# Altium project roach2_project.PrjPCB (part 2 of 13)

## Sheet hwmon.SchDoc: Hardware Monitoring
size A3; Date: DO NOT USE, RATHER USE PROJ OPTIONS; DrawnBy: DO NOT USE, RATHER USE PROJ OPTIONS; Engineer: DO NOT USE, RATHER USE PROJ OPTIONS; Organization: DO NOT USE, RATHER USE PROJ OPTIONS; DocumentNumber: DO NOT USE, RATHER USE PROJ OPTIONS; Revision: DO NOT USE, RATHER USE PROJ OPTIONS; SheetNumber: 3; SheetTotal: 27; SCH_Sheet_Filename: hwmon.SchDoc; CurrentTime: DO NOT USE, RATHER USE PROJ OPTIONS; Time: DO NOT USE, RATHER USE PROJ OPTIONS; DocumentFullPathAndName: DO NOT USE, RATHER USE PROJ OPTIONS; DocumentName: DO NOT USE, RATHER USE PROJ OPTIONS; ModifiedDate: DO NOT USE, RATHER USE PROJ OPTIONS; ImagePath: DO NOT USE, RATHER USE PROJ OPTIONS
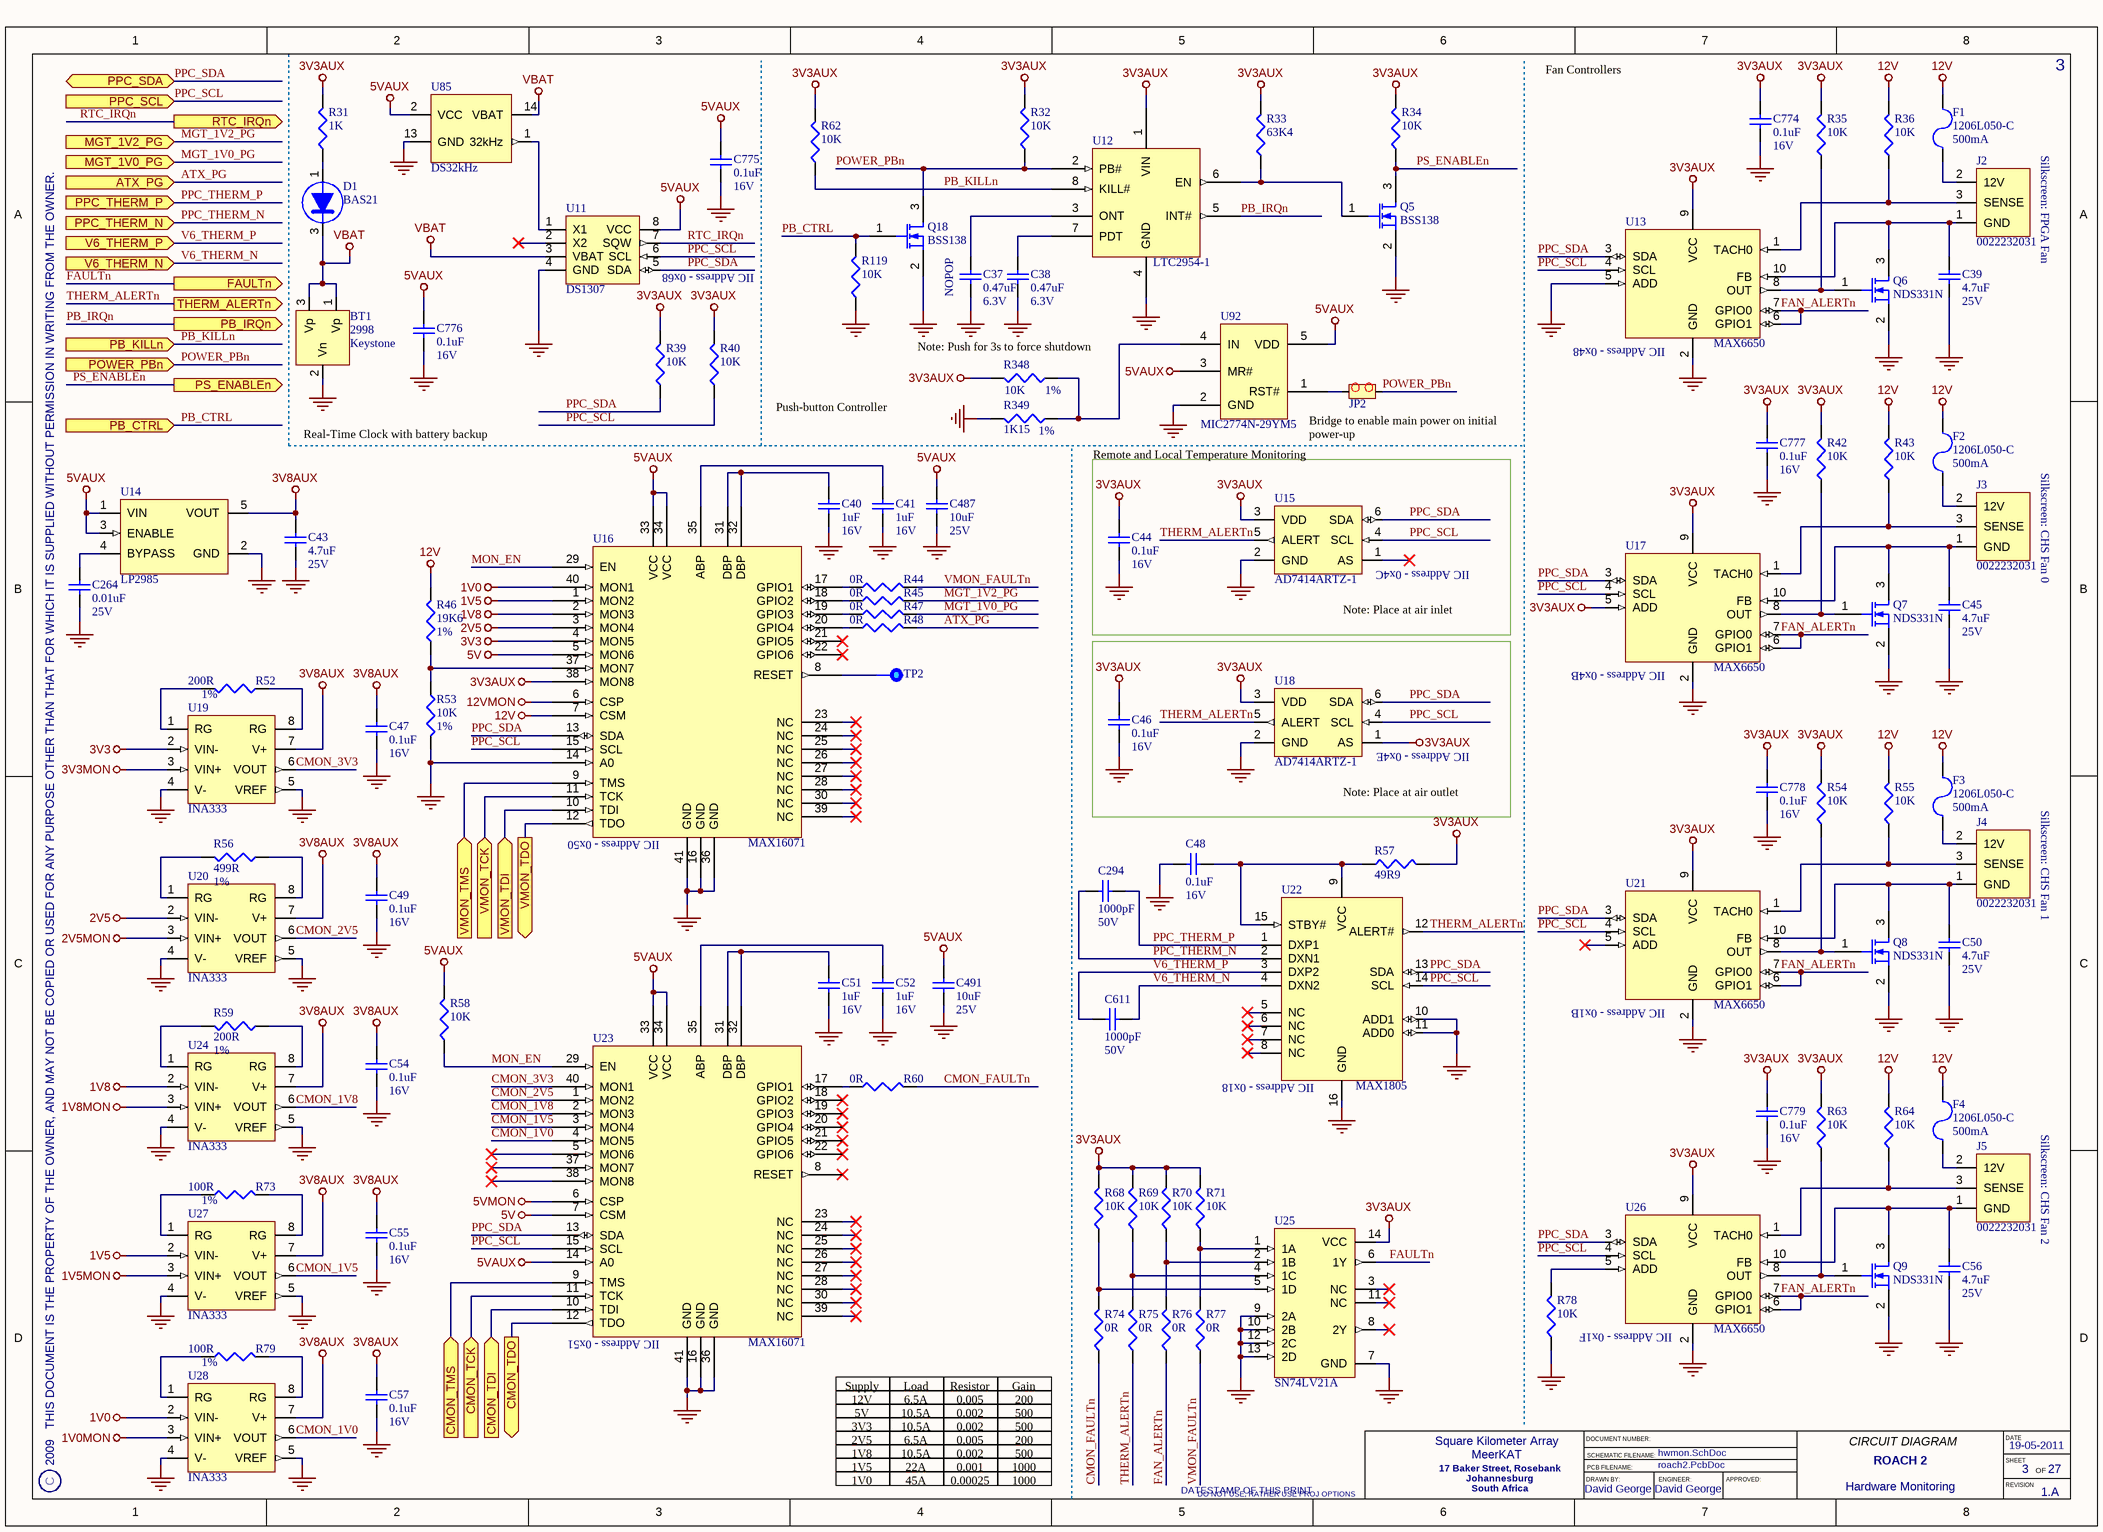
[diagram p3: hwmon.SchDoc]

### Parts
BT1  Manufacturer: Keystone  [KEYELCO_2998]  (hidden comment: 2998)
C37  value 0.47uF  Rating: 6.3V  [CAPC1005X55L]  (hidden comment: CapStd)
C38  value 0.47uF  Rating: 6.3V  [CAPC1005X55L]  (hidden comment: CapStd)
C39  Rating: 25V  [CAPC2012X127L]  (hidden comment: 4.7uF)
C40  Rating: 16V  [CAPC2012X127L]  (hidden comment: 1uF)
C41  Rating: 16V  [CAPC2012X127L]  (hidden comment: 1uF)
C43  Rating: 25V  [CAPC2012X127L]  (hidden comment: 4.7uF)
C44  Rating: 16V  [CAPC1005X60L]  (hidden comment: 0.1uF)
C45  Rating: 25V  [CAPC2012X127L]  (hidden comment: 4.7uF)
C46  Rating: 16V  [CAPC1005X60L]  (hidden comment: 0.1uF)
C47  Rating: 16V  [CAPC1005X60L]  (hidden comment: 0.1uF)
C48  Rating: 16V  [CAPC1005X60L]  (hidden comment: 0.1uF)
C49  Rating: 16V  [CAPC1005X60L]  (hidden comment: 0.1uF)
C50  Rating: 25V  [CAPC2012X127L]  (hidden comment: 4.7uF)
C51  Rating: 16V  [CAPC2012X127L]  (hidden comment: 1uF)
C52  Rating: 16V  [CAPC2012X127L]  (hidden comment: 1uF)
C54  Rating: 16V  [CAPC1005X60L]  (hidden comment: 0.1uF)
C55  Rating: 16V  [CAPC1005X60L]  (hidden comment: 0.1uF)
C56  Rating: 25V  [CAPC2012X127L]  (hidden comment: 4.7uF)
C57  Rating: 16V  [CAPC1005X60L]  (hidden comment: 0.1uF)
C264  value 0.01uF  Rating: 25V  [CAPC1005X55L]  (hidden comment: CapStd)
C294  Rating: 50V  [CAPC1005X55L]  (hidden comment: 1000pF)
C487  Rating: 25V  [CAPC3225X200L]  (hidden comment: 10uF)
C491  Rating: 25V  [CAPC3225X200L]  (hidden comment: 10uF)
C611  Rating: 50V  [CAPC1005X55L]  (hidden comment: 1000pF)
C774  Rating: 16V  [CAPC1005X60L]  (hidden comment: 0.1uF)
C775  Rating: 16V  [CAPC1005X60L]  (hidden comment: 0.1uF)
C776  Rating: 16V  [CAPC1005X60L]  (hidden comment: 0.1uF)
C777  Rating: 16V  [CAPC1005X60L]  (hidden comment: 0.1uF)
C778  Rating: 16V  [CAPC1005X60L]  (hidden comment: 0.1uF)
C779  Rating: 16V  [CAPC1005X60L]  (hidden comment: 0.1uF)
D1  BAS21  [SOT95P245X110-3N]
F1  Rating: 500mA  [FUSMC3215X145]  (hidden comment: 1206L050-C)
F2  Rating: 500mA  [FUSMC3215X145]  (hidden comment: 1206L050-C)
F3  Rating: 500mA  [FUSMC3215X145]  (hidden comment: 1206L050-C)
F4  Rating: 500mA  [FUSMC3215X145]  (hidden comment: 1206L050-C)
J2  0022232031  [MOLEX_0022232031]
J3  0022232031  [MOLEX_0022232031]
J4  0022232031  [MOLEX_0022232031]
J5  0022232031  [MOLEX_0022232031]
JP2  0022032021  [MOLEX_0022032021]  (value not drawn)
Q5  BSS138  [SOT95P245X110-3N]
Q6  NDS331N  [SOT95P245X110-3N]
Q7  NDS331N  [SOT95P245X110-3N]
Q8  NDS331N  [SOT95P245X110-3N]
Q9  NDS331N  [SOT95P245X110-3N]
Q18  BSS138  [SOT95P245X110-3N]
R31  1K  [RESC1005X40L]
R32  10K  [RESC1005X40L]
R33  63K4  [RESC1005X40L]
R34  10K  [RESC1005X40L]
R35  10K  [RESC1005X40L]
R36  10K  [RESC1005X40L]
R39  10K  [RESC1005X40L]
R40  10K  [RESC1005X40L]
R42  10K  [RESC1005X40L]
R43  10K  [RESC1005X40L]
R44  0R  [RESC1005X40L]
R45  0R  [RESC1005X40L]
R46  Tolerance: 1%  [RESC1005X40L]  (hidden comment: 19K6)
R47  0R  [RESC1005X40L]
R48  0R  [RESC1005X40L]
R52  Tolerance: 1%  [RESC1005X40L]  (hidden comment: 200R)
R53  Tolerance: 1%  [RESC1005X40L]  (hidden comment: 10K)
R54  10K  [RESC1005X40L]
R55  10K  [RESC1005X40L]
R56  Tolerance: 1%  [RESC1005X40L]  (hidden comment: 499R)
R57  49R9  [RESC1005X40L]
R58  10K  [RESC1005X40L]
R59  Tolerance: 1%  [RESC1005X40L]  (hidden comment: 200R)
R60  0R  [RESC1005X40L]
R62  10K  [RESC1005X40L]
R63  10K  [RESC1005X40L]
R64  10K  [RESC1005X40L]
R68  10K  [RESC1005X40L]
R69  10K  [RESC1005X40L]
R70  10K  [RESC1005X40L]
R71  10K  [RESC1005X40L]
R73  Tolerance: 1%  [RESC1005X40L]  (hidden comment: 100R)
R74  0R  [RESC1005X40L]
R75  0R  [RESC1005X40L]
R76  0R  [RESC1005X40L]
R77  0R  [RESC1005X40L]
R78  10K  [RESC1005X40L]
R79  Tolerance: 1%  [RESC1005X40L]  (hidden comment: 100R)
R119  10K  [RESC1005X40L]
R348  Tolerance: 1%  [RESC1005X40L]  (hidden comment: 10K)
R349  Tolerance: 1%  [RESC1005X40L]  (hidden comment: 1K15)
TP2  Testpoint  [TP100]  (value not drawn)  (no BOM)
U11  DS1307  [SOIC150-8_N]
U12  LTC2954-1  [TSOT-23-8]
U13  MAX6650  [10L_uMAX]
U14  LP2985  [SOT23-5]
U15  AD7414ARTZ-1  [SOT23-6]
U16  MAX16071  [TQFN-40]
U17  MAX6650  [10L_uMAX]
U18  AD7414ARTZ-1  [SOT23-6]
U19  INA333  [PW08]
U20  INA333  [PW08]
U21  MAX6650  [10L_uMAX]
U22  MAX1805  [QSOP-16]
U23  MAX16071  [TQFN-40]
U24  INA333  [PW08]
U25  SN74LV21A  [PW014]
U26  MAX6650  [10L_uMAX]
U27  INA333  [PW08]
U28  INA333  [PW08]
U85  DS32kHz  [SOIC127P1030X267-16N]
U92  MIC2774N-29YM5  [SOT23-5]

### Blocks framed on the sheet
IIC Address - 0x4C: C44 U15
IIC Address - 0x4E: C46 U18

### Ports
ATX_PG (in), CMON_TCK (in), CMON_TDI (in), CMON_TDO (out), CMON_TMS (in), FAULTn (out), MGT_1V0_PG (in), MGT_1V2_PG (in), PB_CTRL (in), PB_IRQn (out), PB_KILLn (in), POWER_PBn (in), PPC_SCL (in), PPC_SDA (bidir), PPC_THERM_N (in), PPC_THERM_P (in), PS_ENABLEn (out), RTC_IRQn (out), THERM_ALERTn (out), V6_THERM_N (in), V6_THERM_P (in), VMON_TCK (in), VMON_TDI (in), VMON_TDO (out), VMON_TMS (in)

### Nets
1V0: U16.40(MON1) U28.2(VIN-)
1V0MON: U28.3(VIN+)
1V5: U16.1(MON2) U27.2(VIN-)
1V5MON: U27.3(VIN+)
1V8: U16.2(MON3) U24.2(VIN-)
1V8MON: U24.3(VIN+)
2V5: U16.3(MON4) U20.2(VIN-)
2V5MON: U20.3(VIN+)
3V3: U16.4(MON5) U19.2(VIN-)
3V3AUX: C44.2 C46.2 C774.2 C777.2 C778.2 C779.2 R31.2 R32.2 R33.2 R34.2 R35.2 R39.2 R40.2 R42.2 R54.2 R57.2 R62.2 R63.2 R68.2 R69.2 R70.2 R71.2 R348.2 U12.1(VIN) U13.9(VCC) U15.3(VDD) U16.38(MON8) U17.5(ADD) U17.9(VCC) U18.1(AS) U18.3(VDD) U21.9(VCC) U25.14(VCC) U26.9(VCC)
3V3MON: U19.3(VIN+)
3V8AUX: C43.2 C47.2 C49.2 C54.2 C55.2 C57.2 U14.5(VOUT) U19.7(V+) U20.7(V+) U24.7(V+) U27.7(V+) U28.7(V+)
5V: U16.5(MON6) U23.7(CSM)
5VAUX: C487.2 C491.2 C775.2 C776.2 R58.2 U11.8(VCC) U14.1(VIN) U14.3(ENABLE) U16.33(VCC) U16.34(VCC) U23.14(A0) U23.33(VCC) U23.34(VCC) U85.2(VCC) U92.3(MR#) U92.5(VDD)
5VMON: U23.6(CSP)
12V: F1.1 F2.1 F3.1 F4.1 R36.2 R43.2 R46.2 R55.2 R64.2 U16.7(CSM)
12VMON: U16.6(CSP)
GND: BT1.2(Vn) C37.2 C38.2 C39.1 C40.1 C41.1 C43.1 C44.1 C45.1 C46.1 C47.1 C48.2 C49.1 C50.1 C51.1 C52.1 C54.1 C55.1 C56.1 C57.1 C264.1 C487.1 C491.1 C774.1 C775.1 C776.1 C777.1 C778.1 C779.1 Q5.2(S) Q6.2(S) Q7.2(S) Q8.2(S) Q9.2(S) Q18.2(S) R53.2 R78.1 R119.1 R349.2 U11.4(GND) U12.4(GND) U13.2(GND) U13.5(ADD) U14.2(GND) U15.2(GND) U16.14(A0) U16.16(GND) U16.36(GND) U16.41(GND) U17.2(GND) U18.2(GND) U19.4(V-) U19.5(VREF) U20.4(V-) U20.5(VREF) U21.2(GND) U22.10(ADD1) U22.11(ADD0) U22.16(GND) U23.16(GND) U23.36(GND) U23.41(GND) U24.4(V-) U24.5(VREF) U25.7(GND) U25.9(2A) U25.10(2B) U25.12(2C) U25.13(2D) U26.2(GND) U27.4(V-) U27.5(VREF) U28.4(V-) U28.5(VREF) U85.13(GND) U92.2(GND)
VBAT: BT1.1(Vp) BT1.3(Vp) D1.3(K) U11.3(VBAT) U85.14(VBAT)
ATX_PG: R48.2 ; port ATX_PG
CMON_1V0: U23.4(MON5) U28.6(VOUT)
CMON_1V5: U23.3(MON4) U27.6(VOUT)
CMON_1V8: U23.2(MON3) U24.6(VOUT)
CMON_2V5: U20.6(VOUT) U23.1(MON2)
CMON_3V3: U19.6(VOUT) U23.40(MON1)
CMON_FAULTn: R60.2 R74.1
CMON_TCK: U23.11(TCK) ; port CMON_TCK
CMON_TDI: U23.10(TDI) ; port CMON_TDI
CMON_TDO: U23.12(TDO) ; port CMON_TDO
CMON_TMS: U23.9(TMS) ; port CMON_TMS
FAN_ALERTn: R76.1 U13.6(GPIO1) U13.7(GPIO0) U17.6(GPIO1) U17.7(GPIO0) U21.6(GPIO1) U21.7(GPIO0) U26.6(GPIO1) U26.7(GPIO0)
FAULTn: U25.6(1Y) ; port FAULTn
MGT_1V0_PG: R47.2 ; port MGT_1V0_PG
MGT_1V2_PG: R45.2 ; port MGT_1V2_PG
MON_EN: R58.1 U16.29(EN) U23.29(EN)
PB_CTRL: Q18.1(G) R119.2 ; port PB_CTRL
PB_IRQn: U12.5(INT#) ; port PB_IRQn
PB_KILLn: R62.1 U12.8(KILL#) ; port PB_KILLn
POWER_PBn: JP2.2 Q18.3(D) R32.1 U12.2(PB#) ; port POWER_PBn
PPC_SCL: R40.1 U11.6(SCL) U13.4(SCL) U15.4(SCL) U16.15(SCL) U17.4(SCL) U18.4(SCL) U21.4(SCL) U22.14(SCL) U23.15(SCL) U26.4(SCL) ; port PPC_SCL
PPC_SDA: R39.1 U11.5(SDA) U13.3(SDA) U15.6(SDA) U16.13(SDA) U17.3(SDA) U18.6(SDA) U21.3(SDA) U22.13(SDA) U23.13(SDA) U26.3(SDA) ; port PPC_SDA
PPC_THERM_N: C294.1 U22.2(DXN1) ; port PPC_THERM_N
PPC_THERM_P: C294.2 U22.1(DXP1) ; port PPC_THERM_P
PS_ENABLEn: Q5.3(D) R34.1 ; port PS_ENABLEn
RTC_IRQn: U11.7(SQW) ; port RTC_IRQn
THERM_ALERTn: R75.1 U15.5(ALERT) U18.5(ALERT) U22.12(ALERT#) ; port THERM_ALERTn
V6_THERM_N: C611.1 U22.4(DXN2) ; port V6_THERM_N
V6_THERM_P: C611.2 U22.3(DXP2) ; port V6_THERM_P
VMON_FAULTn: R44.2 R77.1
VMON_TCK: U16.11(TCK) ; port VMON_TCK
VMON_TDI: U16.10(TDI) ; port VMON_TDI
VMON_TDO: U16.12(TDO) ; port VMON_TDO
VMON_TMS: U16.9(TMS) ; port VMON_TMS
NetC37_1: C37.1 U12.3(ONT)
NetC38_1: C38.1 U12.7(PDT)
NetC39_2: C39.2 J2.1(GND) Q6.3(D) U13.10(FB)
NetC40_2: C40.2 U16.31(DBP) U16.32(DBP)
NetC41_2: C41.2 U16.35(ABP)
NetC45_2: C45.2 J3.1(GND) Q7.3(D) U17.10(FB)
NetC48_1: C48.1 R57.1 U22.9(VCC) U22.15(STBY#)
NetC50_2: C50.2 J4.1(GND) Q8.3(D) U21.10(FB)
NetC51_2: C51.2 U23.31(DBP) U23.32(DBP)
NetC52_2: C52.2 U23.35(ABP)
NetC56_2: C56.2 J5.1(GND) Q9.3(D) U26.10(FB)
NetC264_2: C264.2 U14.4(BYPASS)
NetD1_1: D1.1(A) R31.1
NetF1_2: F1.2 J2.2(12V)
NetF2_2: F2.2 J3.2(12V)
NetF3_2: F3.2 J4.2(12V)
NetF4_2: F4.2 J5.2(12V)
NetJ2_3: J2.3(SENSE) R36.1 U13.1(TACH0)
NetJ3_3: J3.3(SENSE) R43.1 U17.1(TACH0)
NetJ4_3: J4.3(SENSE) R55.1 U21.1(TACH0)
NetJ5_3: J5.3(SENSE) R64.1 U26.1(TACH0)
NetJP2_1: JP2.1 U92.1(RST#)
NetQ5_1: Q5.1(G) R33.1 U12.6(EN)
NetQ6_1: Q6.1(G) R35.1 U13.8(OUT)
NetQ7_1: Q7.1(G) R42.1 U17.8(OUT)
NetQ8_1: Q8.1(G) R54.1 U21.8(OUT)
NetQ9_1: Q9.1(G) R63.1 U26.8(OUT)
NetR44_1: R44.1 U16.17(GPIO1)
NetR45_1: R45.1 U16.18(GPIO2)
NetR46_1: R46.1 R53.1 U16.37(MON7)
NetR47_1: R47.1 U16.19(GPIO3)
NetR48_1: R48.1 U16.20(GPIO4)
NetR52_1: R52.1 U19.8(RG)
NetR52_2: R52.2 U19.1(RG)
NetR56_1: R56.1 U20.8(RG)
NetR56_2: R56.2 U20.1(RG)
NetR59_1: R59.1 U24.8(RG)
NetR59_2: R59.2 U24.1(RG)
NetR60_1: R60.1 U23.17(GPIO1)
NetR68_1: R68.1 R74.2 U25.5(1D)
NetR69_1: R69.1 R75.2 U25.4(1C)
NetR70_1: R70.1 R76.2 U25.2(1B)
NetR71_1: R71.1 R77.2 U25.1(1A)
NetR73_1: R73.1 U27.1(RG)
NetR73_2: R73.2 U27.8(RG)
NetR78_2: R78.2 U26.5(ADD)
NetR79_1: R79.1 U28.1(RG)
NetR79_2: R79.2 U28.8(RG)
NetR348_1: R348.1 R349.1 U92.4(IN)
NetTP2_1: TP2.1 U16.8(RESET)
NetU11_1: U11.1(X1) U85.1(32kHz)

Not connected (* = marked no-connect by the designer): D1 2(NC); U11 2(X2)*; U15 1(AS)*; U16 21(GPIO5)* 22(GPIO6)* 23(NC)* 24(NC)* 25(NC)* 26(NC)* 27(NC)* 28(NC)* 30(NC)* 39(NC)*; U21 5(ADD)*; U22 5(NC)* 6(NC)* 7(NC)* 8(NC)*; U23 5(MON6)* 8(RESET)* 18(GPIO2)* 19(GPIO3)* 20(GPIO4)* 21(GPIO5)* 22(GPIO6)* 23(NC)* 24(NC)* 25(NC)* 26(NC)* 27(NC)* 28(NC)* 30(NC)* 37(MON7)* 38(MON8)* 39(NC)*; U25 3(NC)* 8(2Y)* 11(NC)*; U85 3(NC) 4(NC) 5(NC) 6(NC) 7(NC) 8(NC) 9(NC) 10(NC) 11(NC) 12(NC) 15(NC) 16(NC)

### Notes on the sheet
- (near C774) Fan Controllers
- Silkscreen: FPGA Fan
- (near U11) IIC Address - 0x68
- (near C37) NOPOP
- (near U13) IIC Address - 0x48
- (near R348) Note: Push for 3s to force shutdown
- Real-Time Clock with battery backup
- (near R349) Push-button Controller
- Remote and Local Temperature Monitoring
- Bridge to enable main power on initial power-up
- Silkscreen: CHS Fan 0
- (near U15) Note: Place at air inlet
- (near U17) IIC Address - 0x4B
- Silkscreen: CHS Fan 1
- (near U16) IIC Address - 0x50
- Note: Place at air outlet
- (near U21) IIC Address - 0x1B
- (near U22) IIC Address - 0x18
- Silkscreen: CHS Fan 2
- (near U23) IIC Address - 0x51
- IIC Address - 0x1F
- (near U23) Supply
- 12V
- 5V
- Load
- 6.5A
- 10.5A
- Resistor
- 0.005
- 0.002
- Gain
- 200
- 500
- 3V3
- 2V5
- 1V8
- 1V5
- 1V0
- 22A
- 45A
- 0.001
- 0.00025
- 1000
- 2009   THIS DOCUMENT IS THE PROPERTY OF THE OWNER, AND MAY NOT BE COPIED OR USED FOR ANY PURPOSE OTHER THAN THAT FOR WHICH IT IS SUPPLIED WITHOUT PERMISSION IN WRITING FROM THE OWNER.
- C
- DATESTAMP OF THIS PRINT
- DRAWN BY:
- DOCUMENT NUMBER:
- SCHEMATIC FILENAME:
- PCB FILENAME:
- ENGINEER:
- APPROVED:
- CIRCUIT DIAGRAM
- DATE
- SHEET
- REVISION
- OF

### Library data of the parts
BT1 = ELMECH-BAT-1: Surface Mount, 6.8mm Coin Cell Retainer; POD number: ELMECH-BAT-1; PartNum: 2998; RoHS: Y; Category: ELMECH; Subcategory: Batteries
C37 C38 = CAP-CER-7: 0.47uF, Ceramic Capacitor; POD number: CAP-CER-7
C39 C43 C45 C50 C56 = CAP-CER-3: 4.7uF, Ceramic Capacitor; Manufacturer: MURATA; PartNum: GRM21BR61E475KA12K; Tolerance: 10%; Dielectric: X5R; POD number: CAP-CER-3; Value: 4.7uF; RoHS: Y; Sort Value: 4.7; Category: Capacitors; Subcategory: Ceramic
C40 C41 C51 C52 = CAP-CER-8: 1uF, Ceramic Capacitor; Manufacturer: MURATA; PartNum: GRM21BR61C105KA01L; Tolerance: 10%; Dielectric: X5R; POD number: CAP-CER-8; Value: 1uF; RoHS: Y; Sort Value: 100; Category: Capacitors; Subcategory: Ceramic
C44 C46-C49 C54 C55 C57 C774-C779 = CAP-CER-1: 0.1uF, Ceramic Capacitor; Manufacturer: VENKEL; PartNum: C0402X7R160-104KN; Tolerance: 10%; Dielectric: X7R; POD number: CAP-CER-1; Value: 0.1uF; RoHS: Y; Sort Value: 0.1; Category: Capacitors; Subcategory: Ceramic
C264 = CAP-CER-6: 0.01uF, Ceramic Capacitor; POD number: CAP-CER-6
C294 C611 = CAP-CER-4: 1000pF, Ceramic Capacitor; Manufacturer: MURATA; PartNum: GRM155R61H102KA01D; Tolerance: 10%; Dielectric: X5R; POD number: CAP-CER-4; Value: 1000pF; RoHS: Y; Sort Value: 0.0001; Category: Capacitors; Subcategory: Ceramic
C487 C491 = CAP-CER-5: 10uF, Ceramic Capacitor; Manufacturer: MURATA; PartNum: GRM32DR61E106KA12L; Tolerance: 10%; Dielectric: X5R; POD number: CAP-CER-5; Value: 10uF; RoHS: Y; Sort Value: 100; Category: Capacitors; Subcategory: Ceramic
D1 = DIODE-STD-0: General Purpose, High Voltage, Diode; Manufacturer: Fairchild Semi; VForward: 1V; POD number: DIODE-STD-0; PartNum: BAS21; RoHS: Y; Category: Diode; Subcategory: STD
F1-F4 = ELMECH-FUSE-0: Resettable, Surface mount Fuse; Manufacturer: Littelfuse; POD number: ELMECH-FUSE-0; PartNum: 1206L050-C; RoHS: Y; Category: ELMECH; Subcategory: Fuses
J2-J5 = CONN-PCB-6: 3-pin ATX Fan Connector; Manufacturer: Molex; POD number: CONN-PCB-6; PartNum: 0022232031; RoHS: Y; Category: CONN; Subcategory: PCB
JP2 = CONN-PCB-14: 1x2, 2.56mm, Header/Jumper; Manufacturer: Molex; POD number: CONN-PCB-14; PartNum: 0022032021; RoHS: Y; Category: CONN; Subcategory: PCB
Q5 Q18 = TRANS-NFET-0: N-Channel Logic Level Enhancement Mode Field Effect Transistor; Manufacturer: Fairchild Semiconductor; Rating: 0.22A; POD number: TRANS-NFET-0; PartNum: BSS138; RoHS: Y; Category: TRANS; Subcategory: NFET
Q6-Q9 = TRANS-NFET-1: N-Channel Logic Level Enhancement Mode Field Effect Transistor; Manufacturer: Fairchild Semiconductor; Rating: 1.3A; POD number: TRANS-NFET-1; PartNum: NDS331N; RoHS: Y; Category: TRANS; Subcategory: NFET
R31 = RES-TF-8: 1K, 1.1mm x 0.5mm, Thick Film Resistor; Manufacturer: ROYALOHM; PartNum: 0402WGJ0102T1E; Tolerance: 5%; Rating: 0.0625W; POD number: RES-TF-8; Value: 1K; Sort Value: 1000; Category: Resistors; Subcategory: ThickFilm; HelpURL: *.pdf
R32 R34-R36 R39 R40 R42 R43 R54 R55 R58 R62-R64 R68-R71 R78 R119 = RES-TF-5: 10K, 1.1mm x 0.5mm, Thick Film Resistor; Manufacturer: ROYALOHM; PartNum: 0402WGJ0103T1E; Tolerance: 5%; Rating: 0.0625W; POD number: RES-TF-5; Value: 10K; Sort Value: 10000; Category: Resistors; Subcategory: ThickFilm; HelpURL: *.pdf
R33 = RES-TF-33: 63K4, 1.1mm x 0.5mm, Thick Film Resistor; Manufacturer: ROYALOHM; PartNum: 0402WGF6342T1E; Tolerance: 1%; Rating: 0.0625W; POD number: RES-TF-33; Value: 63K4; Sort Value: 63400; Category: Resistors; Subcategory: ThickFilm; HelpURL: *.pdf
R44 R45 R47 R48 R60 R74-R77 = RES-TF-0: 0R, 1.1mm x 0.5mm, Thick Film Resistor; Manufacturer: ROYALOHM; PartNum: 0402WG00000T1E; Tolerance: 0%; Rating: 0.0625W; POD number: RES-TF-0; Value: 0R; Sort Value: 0; Category: Resistors; Subcategory: ThickFilm; HelpURL: *.pdf
R46 = RES-TF-29: 19K6, 1.1mm x 0.5mm, Thick Film Resistor; Manufacturer: ROYALOHM; PartNum: 0402WGF1962T1E; Rating: 0.0625W; POD number: RES-TF-29; Value: 19K6; Sort Value: 19600; Category: Resistors; Subcategory: ThickFilm; HelpURL: *.pdf
R52 R59 = RES-TF-19: 200R, 1.1mm x 0.5mm, Thick Film Resistor; Manufacturer: ROYALOHM; PartNum: 0402WGF0201T1E; Rating: 0.0625W; POD number: RES-TF-19; Value: 200R; Sort Value: 200; Category: Resistors; Subcategory: ThickFilm; HelpURL: *.pdf
R53 R348 = RES-TF-20: 10K, 1.1mm x 0.5mm, Thick Film Resistor; Manufacturer: ROYALOHM; PartNum: 0402WGF0103T1E; Rating: 0.0625W; POD number: RES-TF-20; Value: 10K; Sort Value: 10000; Category: Resistors; Subcategory: ThickFilm
  R53: HelpURL: *.pdf
  R348: HelpURL: http://www.royalohm.com/pdf/general.pdf
R56 = RES-TF-21: 499R, 1.1mm x 0.5mm, Thick Film Resistor; Manufacturer: ROYALOHM; PartNum: 0402WGF4990T1E; Rating: 0.0625W; POD number: RES-TF-21; Value: 499R; Sort Value: 499; Category: Resistors; Subcategory: ThickFilm; HelpURL: *.pdf
R57 = RES-TF-10: 49R9, 1.1mm x 0.5mm, Thick Film Resistor; Manufacturer: ROYALOHM; PartNum: 0402WGF499JT1E; Tolerance: 1%; Rating: 0.0625W; POD number: RES-TF-10; Value: 49R9; Sort Value: 49.9; Category: Resistors; Subcategory: ThickFilm; HelpURL: *.pdf
R73 R79 = RES-TF-14: 100R, 1.1mm x 0.5mm, Thick Film Resistor; Manufacturer: ROYALOHM; PartNum: 0402WGF0101T1E; Rating: 0.0625W; POD number: RES-TF-14; Value: 100R; Sort Value: 1000; Category: Resistors; Subcategory: ThickFilm; HelpURL: *.pdf
R349 = RES-TF-28: 1K15, 1.1mm x 0.5mm, Thick Film Resistor; Manufacturer: ROYALOHM; PartNum: 0402WGF1150T1E; Rating: 0.0625W; POD number: RES-TF-28; Value: 1K15; Sort Value: 1150; Category: Resistors; Subcategory: ThickFilm; HelpURL: *.pdf
TP2 = ELMECH-TP-0: 1mm Diameter, through-hole, Circular Test-point; POD number: ELMECH-TP-0; RoHS: Y; Category: ELMECH; Subcategory: Test Points
U11 = IC-MON-5: I2C Real-Time Clock; Manufacturer: Maxim; POD number: IC-MON-5; PartNum: DS1307; RoHS: Y; Category: IC; Subcategory: Monitoring
U12 = IC-MON-8: Push Button On/Off Controller; POD number: IC-MON-8
U13 U17 U21 U26 = IC-MON-2: Fan-Speed Regulators and Monitors with SMBus/I2C-Compatible Interface; Manufacturer: MAXIM; POD number: IC-MON-2; PartNum: MAX6650; RoHS: Y; Category: IC; Subcategory: Monitoring
U14 = IC-REG-8: Micropower, 150mA Low-Noise Ultra Low-Dropout CMOS 3.8V Voltage Regulator in SOT23-5; POD number: IC-REG-8
U15 U18 = IC-MON-6: 0.5 C Accurate, 10-bit Temperature Sensor; Manufacturer: Analog Devices; POD number: IC-MON-6; PartNum: AD7414ARTZ-1; RoHS: Y; Category: IC; Subcategory: Monitoring
U16 U23 = IC-MON-3: 8-Channel, Flash-Configurable System Monitor with Nonvolatile Fault Registers; Manufacturer: Maxim; POD number: IC-MON-3; PartNum: MAX16071; RoHS: Y; Category: IC; Subcategory: Monitoring
U19 U20 U24 U27 U28 = IC-AMP-0: Micro-Power, Zero-Drift, Rail-to-Rail Out Instrumentation Amplifier; Manufacturer: Texas Instruments; POD number: IC-AMP-0; PartNum: INA333; RoHS: Y; Category: IC; Subcategory: Amplifiers
U22 = IC-MON-1: Multichannel Remote/Local Temperature Sensors; Manufacturer: Maxim; POD number: IC-MON-1; PartNum: MAX1805; RoHS: Y; Category: IC; Subcategory: Monitoring
U25 = IC-LOG-2: Dual 4-Input Positive-AND Gates; Manufacturer: Texas Instruments; POD number: IC-LOG-2; PartNum: SN74LV21A; RoHS: Y; Category: IC; Subcategory: Logic
U85 = IC-MON-7: Temperature Compensated, 32.768 kHz Crystal Oscillator; Manufacturer: MAXIM; POD number: IC-MON-7; PartNum: DS32kHz; RoHS: Y; Category: IC; Subcategory: Monitoring
U92 = IC-MON-4: Dual-power low voltage supervisor; Manufacturer: Micrel; POD number: IC-MON-4; PartNum: MIC2774N-29YM5; RoHS: Y; Category: IC; Subcategory: Monitoring

## Sheet jtag_levelxlate.SchDoc: JTAG and Level Translation
size A3; Date: DO NOT USE, RATHER USE PROJ OPTIONS; DrawnBy: DO NOT USE, RATHER USE PROJ OPTIONS; Engineer: DO NOT USE, RATHER USE PROJ OPTIONS; Organization: DO NOT USE, RATHER USE PROJ OPTIONS; DocumentNumber: DO NOT USE, RATHER USE PROJ OPTIONS; Revision: DO NOT USE, RATHER USE PROJ OPTIONS; SheetNumber: 26; SheetTotal: 27; SCH_Sheet_Filename: jtag_levelxlate.SchDoc; CurrentTime: DO NOT USE, RATHER USE PROJ OPTIONS; Time: DO NOT USE, RATHER USE PROJ OPTIONS; DocumentFullPathAndName: DO NOT USE, RATHER USE PROJ OPTIONS; DocumentName: DO NOT USE, RATHER USE PROJ OPTIONS; ModifiedDate: DO NOT USE, RATHER USE PROJ OPTIONS; ImagePath: DO NOT USE, RATHER USE PROJ OPTIONS
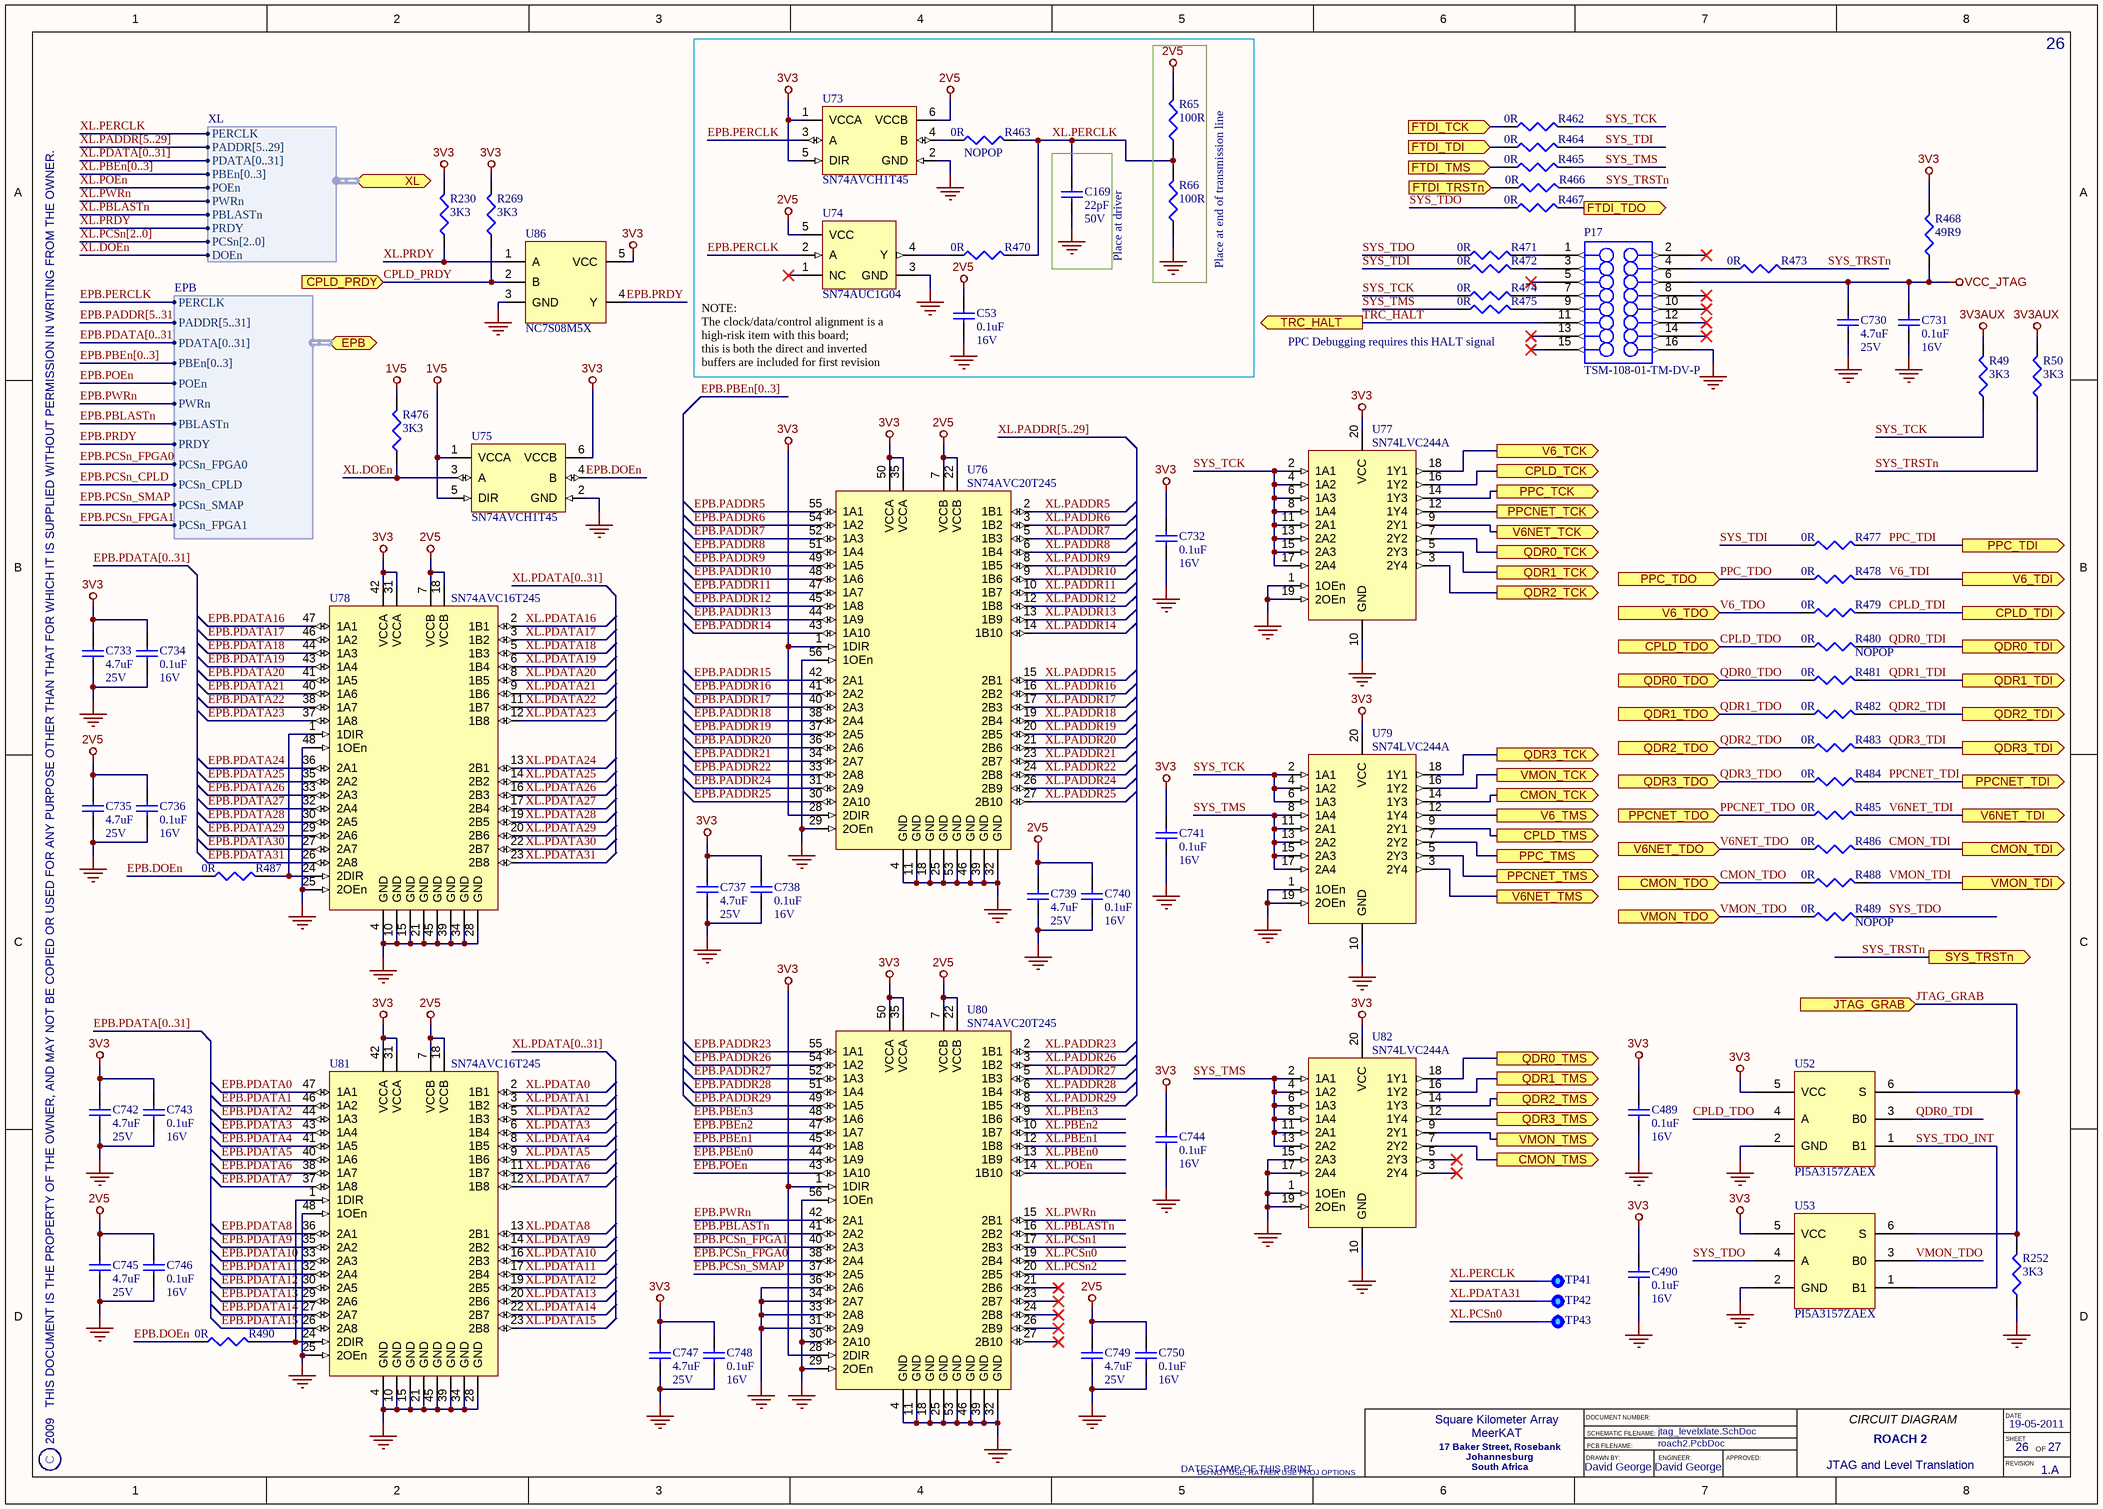
[diagram p4: jtag_levelxlate.SchDoc]

### Parts
C53  Rating: 16V  [CAPC1005X60L]  (hidden comment: 0.1uF)
C169  Rating: 50V  [CAPC1005X55L]  (hidden comment: 22pF)
C489  Rating: 16V  [CAPC1005X60L]  (hidden comment: 0.1uF)
C490  Rating: 16V  [CAPC1005X60L]  (hidden comment: 0.1uF)
C730  Rating: 25V  [CAPC2012X127L]  (hidden comment: 4.7uF)
C731  Rating: 16V  [CAPC1005X60L]  (hidden comment: 0.1uF)
C732  Rating: 16V  [CAPC1005X60L]  (hidden comment: 0.1uF)
C733  Rating: 25V  [CAPC2012X127L]  (hidden comment: 4.7uF)
C734  Rating: 16V  [CAPC1005X60L]  (hidden comment: 0.1uF)
C735  Rating: 25V  [CAPC2012X127L]  (hidden comment: 4.7uF)
C736  Rating: 16V  [CAPC1005X60L]  (hidden comment: 0.1uF)
C737  Rating: 25V  [CAPC2012X127L]  (hidden comment: 4.7uF)
C738  Rating: 16V  [CAPC1005X60L]  (hidden comment: 0.1uF)
C739  Rating: 25V  [CAPC2012X127L]  (hidden comment: 4.7uF)
C740  Rating: 16V  [CAPC1005X60L]  (hidden comment: 0.1uF)
C741  Rating: 16V  [CAPC1005X60L]  (hidden comment: 0.1uF)
C742  Rating: 25V  [CAPC2012X127L]  (hidden comment: 4.7uF)
C743  Rating: 16V  [CAPC1005X60L]  (hidden comment: 0.1uF)
C744  Rating: 16V  [CAPC1005X60L]  (hidden comment: 0.1uF)
C745  Rating: 25V  [CAPC2012X127L]  (hidden comment: 4.7uF)
C746  Rating: 16V  [CAPC1005X60L]  (hidden comment: 0.1uF)
C747  Rating: 25V  [CAPC2012X127L]  (hidden comment: 4.7uF)
C748  Rating: 16V  [CAPC1005X60L]  (hidden comment: 0.1uF)
C749  Rating: 25V  [CAPC2012X127L]  (hidden comment: 4.7uF)
C750  Rating: 16V  [CAPC1005X60L]  (hidden comment: 0.1uF)
P17  TSM-108-01-TM-DV-P  [SAMTEC_TSM-108-01-TM-DV-P]
R49  3K3  [RESC1005X40L]
R50  3K3  [RESC1005X40L]
R65  100R  [RESC1005X40L]
R66  100R  [RESC1005X40L]
R230  3K3  [RESC1005X40L]
R252  3K3  [RESC1005X40L]
R269  3K3  [RESC1005X40L]
R462  0R  [RESC1005X40L]
R463  0R  [RESC1005X40L]
R464  0R  [RESC1005X40L]
R465  0R  [RESC1005X40L]
R466  0R  [RESC1005X40L]
R467  0R  [RESC1005X40L]
R468  49R9  [RESC1005X40L]
R470  0R  [RESC1005X40L]
R471  0R  [RESC1005X40L]
R472  0R  [RESC1005X40L]
R473  0R  [RESC1005X40L]
R474  0R  [RESC1005X40L]
R475  0R  [RESC1005X40L]
R476  3K3  [RESC1005X40L]
R477  0R  [RESC1005X40L]
R478  0R  [RESC1005X40L]
R479  0R  [RESC1005X40L]
R480  0R  [RESC1005X40L]
R481  0R  [RESC1005X40L]
R482  0R  [RESC1005X40L]
R483  0R  [RESC1005X40L]
R484  0R  [RESC1005X40L]
R485  0R  [RESC1005X40L]
R486  0R  [RESC1005X40L]
R487  0R  [RESC1005X40L]
R488  0R  [RESC1005X40L]
R489  0R  [RESC1005X40L]
R490  0R  [RESC1005X40L]
TP41  Testpoint  [TP100]  (value not drawn)  (no BOM)
TP42  Testpoint  [TP100]  (value not drawn)  (no BOM)
TP43  Testpoint  [TP100]  (value not drawn)  (no BOM)
U52  PI5A3157ZAEX  [SC70-6]
U53  PI5A3157ZAEX  [SC70-6]
U73  SN74AVCH1T45  [SOT23-6]
U74  SN74AUC1G04  [SOT23-5]
U75  SN74AVCH1T45  [SOT23-6]
U76  SN74AVC20T245  [PW056]
U77  SN74LVC244A  [PW020]
U78  SN74AVC16T245  [PW048]
U79  SN74LVC244A  [PW020]
U80  SN74AVC20T245  [PW056]
U81  SN74AVC16T245  [PW048]
U82  SN74LVC244A  [PW020]
U86  NC7S08M5X  [SOT23-5]

### Ports
CMON_TCK (out), CMON_TDI (out), CMON_TDO (in), CMON_TMS (out), CPLD_PRDY (in), CPLD_TCK (out), CPLD_TDI (out), CPLD_TDO (in), CPLD_TMS (out), EPB (harness EPB), FTDI_TCK (in), FTDI_TDI (in), FTDI_TDO (out), FTDI_TMS (in), FTDI_TRSTn (in), JTAG_GRAB (in), PPC_TCK (out), PPC_TDI (out), PPC_TDO (in), PPC_TMS (out), PPCNET_TCK (out), PPCNET_TDI (out), PPCNET_TDO (in), PPCNET_TMS (out), QDR0_TCK (out), QDR0_TDI (out), QDR0_TDO (in), QDR0_TMS (out), QDR1_TCK (out), QDR1_TDI (out), QDR1_TDO (in), QDR1_TMS (out), QDR2_TCK (out), QDR2_TDI (out), QDR2_TDO (in), QDR2_TMS (out), QDR3_TCK (out), QDR3_TDI (out), QDR3_TDO (in), QDR3_TMS (out), SYS_TRSTn (out), TRC_HALT (out), V6_TCK (out), V6_TDI (out), V6_TDO (in), V6_TMS (out), V6NET_TCK (out), V6NET_TDI (out), V6NET_TDO (in), V6NET_TMS (out), VMON_TCK (out), VMON_TDI (out), VMON_TDO (in), VMON_TMS (out), XL (harness XL)

### Harnesses
EPB: PERCLK, PADDR[5..31], PDATA[0..31], PBEn[0..3], POEn, PWRn, PBLASTn, PRDY, PCSn_FPGA0, PCSn_CPLD, PCSn_SMAP, PCSn_FPGA1
XL: PERCLK, PADDR[5..29], PDATA[0..31], PBEn[0..3], POEn, PWRn, PBLASTn, PRDY, PCSn[2..0], DOEn

### Nets
1V5: R476.2 U75.1(VCCA) U75.5(DIR)
2V5: C53.2 C735.2 C736.2 C739.2 C740.2 C745.2 C746.2 C749.2 C750.2 R65.2 U73.6(VCCB) U74.5(VCC) U76.7(VCCB) U76.22(VCCB) U78.7(VCCB) U78.18(VCCB) U80.7(VCCB) U80.22(VCCB) U81.7(VCCB) U81.18(VCCB)
3V3: C489.2 C490.2 C732.2 C733.2 C734.2 C737.2 C738.2 C741.2 C742.2 C743.2 C744.2 C747.2 C748.2 R230.2 R269.2 R468.2 U52.5(VCC) U53.5(VCC) U73.1(VCCA) U73.5(DIR) U75.6(VCCB) U76.1(1DIR) U76.28(2DIR) U76.35(VCCA) U76.50(VCCA) U77.20(VCC) U78.31(VCCA) U78.42(VCCA) U79.20(VCC) U80.1(1DIR) U80.28(2DIR) U80.35(VCCA) U80.50(VCCA) U81.31(VCCA) U81.42(VCCA) U82.20(VCC) U86.5(VCC)
3V3AUX: R49.2 R50.2
GND: C53.1 C169.1 C489.1 C490.1 C730.1 C731.1 C732.1 C733.1 C734.1 C735.1 C736.1 C737.1 C738.1 C739.1 C740.1 C741.1 C742.1 C743.1 C744.1 C745.1 C746.1 C747.1 C748.1 C749.1 C750.1 P17.16(B16) R66.1 R252.1 U52.2(GND) U53.2(GND) U73.2(GND) U74.3(GND) U75.2(GND) U76.4(GND) U76.11(GND) U76.18(GND) U76.25(GND) U76.29(2OEn) U76.32(GND) U76.39(GND) U76.46(GND) U76.53(GND) U76.56(1OEn) U77.1(1OEn) U77.10(GND) U77.19(2OEn) U78.4(GND) U78.10(GND) U78.15(GND) U78.21(GND) U78.25(2OEn) U78.28(GND) U78.34(GND) U78.39(GND) U78.45(GND) U78.48(1OEn) U79.1(1OEn) U79.10(GND) U79.19(2OEn) U80.4(GND) U80.11(GND) U80.18(GND) U80.25(GND) U80.29(2OEn) U80.30(2A10) U80.31(2A9) U80.32(GND) U80.33(2A8) U80.34(2A7) U80.36(2A6) U80.39(GND) U80.46(GND) U80.53(GND) U80.56(1OEn) U81.4(GND) U81.10(GND) U81.15(GND) U81.21(GND) U81.25(2OEn) U81.28(GND) U81.34(GND) U81.39(GND) U81.45(GND) U81.48(1OEn) U82.1(1OEn) U82.10(GND) U82.15(2A3) U82.17(2A4) U82.19(2OEn) U86.3(GND)
VCC_JTAG: C730.2 C731.2 P17.6(B6) R468.1
CMON_TCK: U79.14(1Y3) ; port CMON_TCK
CMON_TDI: R486.2 ; port CMON_TDI
CMON_TDO: R488.1 ; port CMON_TDO
CMON_TMS: U82.7(2Y2) ; port CMON_TMS
CPLD_PRDY: R269.1 U86.2(B) ; port CPLD_PRDY
CPLD_TCK: U77.16(1Y2) ; port CPLD_TCK
CPLD_TDI: R479.2 ; port CPLD_TDI
CPLD_TDO: R480.1 U52.4(A) ; port CPLD_TDO
CPLD_TMS: U79.9(2Y1) ; port CPLD_TMS
EPB.DOEn: R487.1 R490.1 U75.4(B)
EPB.PADDR5: U76.55(1A1)
EPB.PADDR6: U76.54(1A2)
EPB.PADDR7: U76.52(1A3)
EPB.PADDR8: U76.51(1A4)
EPB.PADDR9: U76.49(1A5)
EPB.PADDR10: U76.48(1A6)
EPB.PADDR11: U76.47(1A7)
EPB.PADDR12: U76.45(1A8)
EPB.PADDR13: U76.44(1A9)
EPB.PADDR14: U76.43(1A10)
EPB.PADDR15: U76.42(2A1)
EPB.PADDR16: U76.41(2A2)
EPB.PADDR17: U76.40(2A3)
EPB.PADDR18: U76.38(2A4)
EPB.PADDR19: U76.37(2A5)
EPB.PADDR20: U76.36(2A6)
EPB.PADDR21: U76.34(2A7)
EPB.PADDR22: U76.33(2A8)
EPB.PADDR23: U80.55(1A1)
EPB.PADDR24: U76.31(2A9)
EPB.PADDR25: U76.30(2A10)
EPB.PADDR26: U80.54(1A2)
EPB.PADDR27: U80.52(1A3)
EPB.PADDR28: U80.51(1A4)
EPB.PADDR29: U80.49(1A5)
EPB.PBEn0: U80.44(1A9)
EPB.PBEn1: U80.45(1A8)
EPB.PBEn2: U80.47(1A7)
EPB.PBEn3: U80.48(1A6)
EPB.PBLASTn: U80.41(2A2) ; port EPB.PBLASTn
EPB.PCSn_FPGA0: U80.38(2A4) ; port EPB.PCSn_FPGA0
EPB.PCSn_FPGA1: U80.40(2A3) ; port EPB.PCSn_FPGA1
EPB.PCSn_SMAP: U80.37(2A5) ; port EPB.PCSn_SMAP
EPB.PDATA0: U81.47(1A1)
EPB.PDATA1: U81.46(1A2)
EPB.PDATA2: U81.44(1A3)
EPB.PDATA3: U81.43(1A4)
EPB.PDATA4: U81.41(1A5)
EPB.PDATA5: U81.40(1A6)
EPB.PDATA6: U81.38(1A7)
EPB.PDATA7: U81.37(1A8)
EPB.PDATA8: U81.36(2A1)
EPB.PDATA9: U81.35(2A2)
EPB.PDATA10: U81.33(2A3)
EPB.PDATA11: U81.32(2A4)
EPB.PDATA12: U81.30(2A5)
EPB.PDATA13: U81.29(2A6)
EPB.PDATA14: U81.27(2A7)
EPB.PDATA15: U81.26(2A8)
EPB.PDATA16: U78.47(1A1)
EPB.PDATA17: U78.46(1A2)
EPB.PDATA18: U78.44(1A3)
EPB.PDATA19: U78.43(1A4)
EPB.PDATA20: U78.41(1A5)
EPB.PDATA21: U78.40(1A6)
EPB.PDATA22: U78.38(1A7)
EPB.PDATA23: U78.37(1A8)
EPB.PDATA24: U78.36(2A1)
EPB.PDATA25: U78.35(2A2)
EPB.PDATA26: U78.33(2A3)
EPB.PDATA27: U78.32(2A4)
EPB.PDATA28: U78.30(2A5)
EPB.PDATA29: U78.29(2A6)
EPB.PDATA30: U78.27(2A7)
EPB.PDATA31: U78.26(2A8)
EPB.PERCLK: U73.3(A) U74.2(A) ; port EPB.PERCLK
EPB.POEn: U80.43(1A10) ; port EPB.POEn
EPB.PRDY: U86.4(Y) ; port EPB.PRDY
EPB.PWRn: U80.42(2A1) ; port EPB.PWRn
FTDI_TCK: R462.1 ; port FTDI_TCK
FTDI_TDI: R464.1 ; port FTDI_TDI
FTDI_TDO: R467.2 ; port FTDI_TDO
FTDI_TMS: R465.1 ; port FTDI_TMS
FTDI_TRSTn: R466.1 ; port FTDI_TRSTn
JTAG_GRAB: R252.2 U52.6(S) U53.6(S) ; port JTAG_GRAB
PPC_TCK: U77.14(1Y3) ; port PPC_TCK
PPC_TDI: R477.2 ; port PPC_TDI
PPC_TDO: R478.1 ; port PPC_TDO
PPC_TMS: U79.7(2Y2) ; port PPC_TMS
PPCNET_TCK: U77.12(1Y4) ; port PPCNET_TCK
PPCNET_TDI: R484.2 ; port PPCNET_TDI
PPCNET_TDO: R485.1 ; port PPCNET_TDO
PPCNET_TMS: U79.5(2Y3) ; port PPCNET_TMS
QDR0_TCK: U77.7(2Y2) ; port QDR0_TCK
QDR0_TDI: R480.2 U52.3(B0) ; port QDR0_TDI
QDR0_TDO: R481.1 ; port QDR0_TDO
QDR0_TMS: U82.18(1Y1) ; port QDR0_TMS
QDR1_TCK: U77.5(2Y3) ; port QDR1_TCK
QDR1_TDI: R481.2 ; port QDR1_TDI
QDR1_TDO: R482.1 ; port QDR1_TDO
QDR1_TMS: U82.16(1Y2) ; port QDR1_TMS
QDR2_TCK: U77.3(2Y4) ; port QDR2_TCK
QDR2_TDI: R482.2 ; port QDR2_TDI
QDR2_TDO: R483.1 ; port QDR2_TDO
QDR2_TMS: U82.14(1Y3) ; port QDR2_TMS
QDR3_TCK: U79.18(1Y1) ; port QDR3_TCK
QDR3_TDI: R483.2 ; port QDR3_TDI
QDR3_TDO: R484.1 ; port QDR3_TDO
QDR3_TMS: U82.12(1Y4) ; port QDR3_TMS
SYS_TCK: R49.1 R462.2 R474.1 U77.2(1A1) U77.4(1A2) U77.6(1A3) U77.8(1A4) U77.11(2A1) U77.13(2A2) U77.15(2A3) U77.17(2A4) U79.2(1A1) U79.4(1A2) U79.6(1A3)
SYS_TDI: R464.2 R472.1 R477.1
SYS_TDO: R467.1 R471.1 R489.2 U53.4(A)
SYS_TDO_INT: U52.1(B1) U53.1(B1)
SYS_TMS: R465.2 R475.1 U79.8(1A4) U79.11(2A1) U79.13(2A2) U79.15(2A3) U79.17(2A4) U82.2(1A1) U82.4(1A2) U82.6(1A3) U82.8(1A4) U82.11(2A1) U82.13(2A2)
SYS_TRSTn: R50.1 R466.2 R473.2 ; port SYS_TRSTn
TRC_HALT: P17.11(A11) ; port TRC_HALT
V6_TCK: U77.18(1Y1) ; port V6_TCK
V6_TDI: R478.2 ; port V6_TDI
V6_TDO: R479.1 ; port V6_TDO
V6_TMS: U79.12(1Y4) ; port V6_TMS
V6NET_TCK: U77.9(2Y1) ; port V6NET_TCK
V6NET_TDI: R485.2 ; port V6NET_TDI
V6NET_TDO: R486.1 ; port V6NET_TDO
V6NET_TMS: U79.3(2Y4) ; port V6NET_TMS
VMON_TCK: U79.16(1Y2) ; port VMON_TCK
VMON_TDI: R488.2 ; port VMON_TDI
VMON_TDO: R489.1 U53.3(B0) ; port VMON_TDO
VMON_TMS: U82.9(2Y1) ; port VMON_TMS
XL.DOEn: R476.1 U75.3(A) ; port XL.DOEn
XL.PADDR5: U76.2(1B1)
XL.PADDR6: U76.3(1B2)
XL.PADDR7: U76.5(1B3)
XL.PADDR8: U76.6(1B4)
XL.PADDR9: U76.8(1B5)
XL.PADDR10: U76.9(1B6)
XL.PADDR11: U76.10(1B7)
XL.PADDR12: U76.12(1B8)
XL.PADDR13: U76.13(1B9)
XL.PADDR14: U76.14(1B10)
XL.PADDR15: U76.15(2B1)
XL.PADDR16: U76.16(2B2)
XL.PADDR17: U76.17(2B3)
XL.PADDR18: U76.19(2B4)
XL.PADDR19: U76.20(2B5)
XL.PADDR20: U76.21(2B6)
XL.PADDR21: U76.23(2B7)
XL.PADDR22: U76.24(2B8)
XL.PADDR23: U80.2(1B1)
XL.PADDR24: U76.26(2B9)
XL.PADDR25: U76.27(2B10)
XL.PADDR26: U80.3(1B2)
XL.PADDR27: U80.5(1B3)
XL.PADDR28: U80.6(1B4)
XL.PADDR29: U80.8(1B5)
XL.PBEn0: U80.13(1B9)
XL.PBEn1: U80.12(1B8)
XL.PBEn2: U80.10(1B7)
XL.PBEn3: U80.9(1B6)
XL.PBLASTn: U80.16(2B2) ; port XL.PBLASTn
XL.PCSn0: TP43.1 U80.19(2B4)
XL.PCSn1: U80.17(2B3)
XL.PCSn2: U80.20(2B5)
XL.PDATA0: U81.2(1B1)
XL.PDATA1: U81.3(1B2)
XL.PDATA2: U81.5(1B3)
XL.PDATA3: U81.6(1B4)
XL.PDATA4: U81.8(1B5)
XL.PDATA5: U81.9(1B6)
XL.PDATA6: U81.11(1B7)
XL.PDATA7: U81.12(1B8)
XL.PDATA8: U81.13(2B1)
XL.PDATA9: U81.14(2B2)
XL.PDATA10: U81.16(2B3)
XL.PDATA11: U81.17(2B4)
XL.PDATA12: U81.19(2B5)
XL.PDATA13: U81.20(2B6)
XL.PDATA14: U81.22(2B7)
XL.PDATA15: U81.23(2B8)
XL.PDATA16: U78.2(1B1)
XL.PDATA17: U78.3(1B2)
XL.PDATA18: U78.5(1B3)
XL.PDATA19: U78.6(1B4)
XL.PDATA20: U78.8(1B5)
XL.PDATA21: U78.9(1B6)
XL.PDATA22: U78.11(1B7)
XL.PDATA23: U78.12(1B8)
XL.PDATA24: U78.13(2B1)
XL.PDATA25: U78.14(2B2)
XL.PDATA26: U78.16(2B3)
XL.PDATA27: U78.17(2B4)
XL.PDATA28: U78.19(2B5)
XL.PDATA29: U78.20(2B6)
XL.PDATA30: U78.22(2B7)
XL.PDATA31: TP42.1 U78.23(2B8)
XL.PERCLK: C169.2 R65.1 R66.2 R463.2 R470.2 TP41.1 ; port XL.PERCLK
XL.POEn: U80.14(1B10) ; port XL.POEn
XL.PRDY: R230.1 U86.1(A) ; port XL.PRDY
XL.PWRn: U80.15(2B1) ; port XL.PWRn
NetP17_1: P17.1(A1) R471.2
NetP17_3: P17.3(A3) R472.2
NetP17_4: P17.4(B4) R473.1
NetP17_7: P17.7(A7) R474.2
NetP17_9: P17.9(A9) R475.2
NetR463_1: R463.1 U73.4(B)
NetR470_1: R470.1 U74.4(Y)
NetR487_2: R487.2 U78.1(1DIR) U78.24(2DIR)
NetR490_2: R490.2 U81.1(1DIR) U81.24(2DIR)

Not connected (* = marked no-connect by the designer): P17 2(B2)* 5(A5)* 8(B8)* 10(B10)* 12(B12)* 13(A13)* 14(B14)* 15(A15)*; U74 1(NC)*; U80 21(2B6)* 23(2B7)* 24(2B8)* 26(2B9)* 27(2B10)*; U82 3(2Y4)* 5(2Y3)*

### Buses and harness runs
bus EPB.PADDR[5..31]
bus EPB.PBEn[0..3]
bus EPB.PDATA[0..31]
bus XL.PADDR[5..29]
bus XL.PBEn[0..3]
bus XL.PCSn[2..0]
bus XL.PDATA[0..31]

### Notes on the sheet
- (near R463) NOPOP
- Place at driver
- Place at end of transmission line
- (near U74) NOTE:
  The clock/data/control alignment is a
  high-risk item with this board;
  this is both the direct and inverted
  buffers are included for first revision
- PPC Debugging requires this HALT signal
- (near R480) NOPOP
- (near R489) NOPOP
- 2009   THIS DOCUMENT IS THE PROPERTY OF THE OWNER, AND MAY NOT BE COPIED OR USED FOR ANY PURPOSE OTHER THAN THAT FOR WHICH IT IS SUPPLIED WITHOUT PERMISSION IN WRITING FROM THE OWNER.
- C
- DATESTAMP OF THIS PRINT
- DRAWN BY:
- DOCUMENT NUMBER:
- SCHEMATIC FILENAME:
- PCB FILENAME:
- ENGINEER:
- APPROVED:
- CIRCUIT DIAGRAM
- DATE
- SHEET
- REVISION
- OF

### Library data of the parts
C53 C489 C490 C731 C732 C734 C736 C738 C740 C741 C743 C744 C746 C748 C750 = CAP-CER-1: as C44 on sheet hwmon; POD number: CAP-CER-1; Value: 0.1uF; RoHS: Y; Sort Value: 0.1; Category: Capacitors; Subcategory: Ceramic
C169 = CAP-CER-2: 22pF, Ceramic Capacitor; Manufacturer: MURATA; PartNum: GRM1555C1H220JZ01D; Tolerance: 5%; Dielectric: C0G; POD number: CAP-CER-2; Value: 22pF; RoHS: Y; Sort Value: 0.000022; Category: Capacitors; Subcategory: Ceramic
C730 C733 C735 C737 C739 C742 C745 C747 C749 = CAP-CER-3: as C39 on sheet hwmon; POD number: CAP-CER-3; Value: 4.7uF; RoHS: Y; Sort Value: 4.7; Category: Capacitors; Subcategory: Ceramic
P17 = CONN-PCB-11: 2x8, 2.54 mm Pitch, Male Header; Manufacturer: SAMTEC; POD number: CONN-PCB-11; PartNum: TSM-108-01-TM-DV-P; RoHS: Y; Category: CONN; Subcategory: PCB
R49 R50 R230 R252 R269 R476 = RES-TF-7: 3K3, 1.1mm x 0.5mm, Thick Film Resistor; Manufacturer: ROYALOHM; PartNum: 0402WGJ0332T1E; Tolerance: 5%; Rating: 0.0625W; POD number: RES-TF-7; Value: 3K3; Sort Value: 3300; Category: Resistors; Subcategory: ThickFilm; HelpURL: *.pdf
R65 R66 = RES-TF-14: 100R, 1.1mm x 0.5mm, Thick Film Resistor; Manufacturer: ROYALOHM; PartNum: 0402WGF0101T1E; Tolerance: 1%; Rating: 0.0625W; POD number: RES-TF-14; Value: 100R; Sort Value: 100; Category: Resistors; Subcategory: ThickFilm; HelpURL: http://www.royalohm.com/pdf/general.pdf
R462-R467 R470-R475 R477-R490 = RES-TF-0: as R44 on sheet hwmon; POD number: RES-TF-0; Value: 0R; Sort Value: 0; Category: Resistors; Subcategory: ThickFilm; HelpURL: *.pdf
R468 = RES-TF-10: as R57 on sheet hwmon; POD number: RES-TF-10; Value: 49R9; Sort Value: 49.9; Category: Resistors; Subcategory: ThickFilm; HelpURL: *.pdf
TP41-TP43 = ELMECH-TP-0: as TP2 on sheet hwmon; POD number: ELMECH-TP-0; RoHS: Y; Category: ELMECH; Subcategory: Test Points
U52 U53 = IC-LOG-5: Low voltage SPDT Analogue Switch; Manufacturer: PERICOM; POD number: IC-LOG-5; PartNum: PI5A3157ZAEX; RoHS: Y; Category: IC; Subcategory: Logic
U73 U75 = IC-LOG-13: Single-Bit Dual Supply Bus Transceiver with Configurable Voltage Translation and 3-State Outputs; Manufacturer: Texas Instruments; POD number: IC-LOG-13; PartNum: SN74AVCH1T45; RoHS: Y; Category: IC; Subcategory: Logic
U74 = IC-LOG-1: Single Inverter Gate; Manufacturer: Texas Instruments; POD number: IC-LOG-1; PartNum: SN74AUC1G04; RoHS: Y; Category: IC; Subcategory: Logic
U76 U80 = IC-LOG-12: 20-Bit Dual-Supply Bus Transceivers with Configurable Voltage Translation and 3-State Outputs; Manufacturer: Texas Instruments; POD number: IC-LOG-12; PartNum: SN74AVC20T245; RoHS: Y; Category: IC; Subcategory: Logic
U77 U79 U82 = IC-LOG-4: Octal Buffer/Drive with 3-State Outputs; Manufacturer: Texas Instruments; POD number: IC-LOG-4; PartNum: SN74LVC244A; RoHS: Y; Category: IC; Subcategory: Logic
U78 U81 = IC-LOG-11: 16-BIT DUAL-SUPPLY BUS TRANSCEIVER WITH CONFIGURABLE VOLTAGE TRANSLATION AND 3-STATE OUTPUTS; Manufacturer: Texas Instruments; POD number: IC-LOG-11; PartNum: SN74AVC16T245; RoHS: Y; Category: IC; Subcategory: Logic
U86 = IC-LOG-0: TinyLogic® HS 2-Input AND Gate; Manufacturer: Fairchild Semiconductor; POD number: IC-LOG-0; PartNum: NC7S08M5X; RoHS: Y; Category: IC; Subcategory: Logic